# Altium schematic sheet Fiducials.SchDoc
size A4; DocumentNumber: 9; SheetNumber: 9; SheetTotal: 9
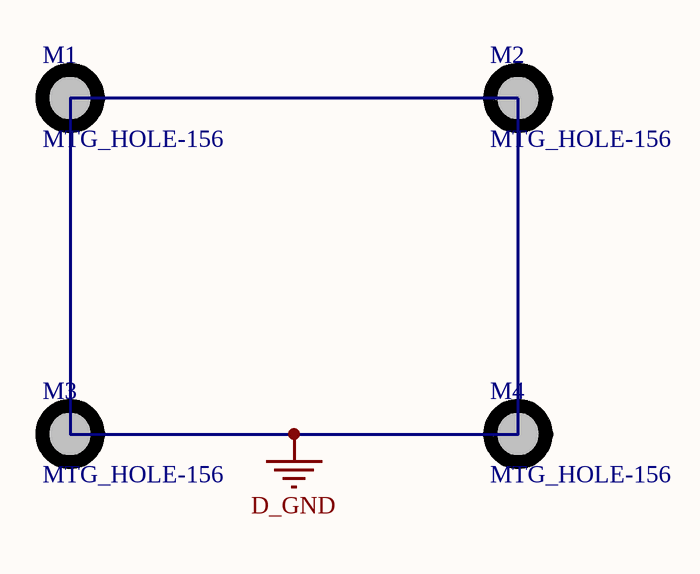
[diagram p0: Fiducials.SchDoc]

## Parts
M1  MTG_HOLE-156  [MtgHole-156_P]
M2  MTG_HOLE-156  [MtgHole-156_P]
M3  MTG_HOLE-156  [MtgHole-156_P]
M4  MTG_HOLE-156  [MtgHole-156_P]